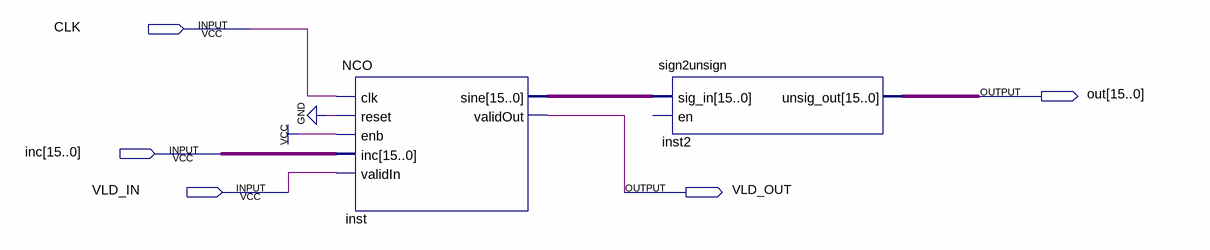
[diagram p0: schematic sheet]
// Quartus schematic Subsystem_quartus.bdf as structural Verilog: 2 symbols, 5 pins
module Subsystem_quartus (
  input  CLK,
  input  [15:0] inc,
  input  VLD_IN,
  output [15:0] out,
  output VLD_OUT
);

  wire [15:0] inst_sine;

  NCO inst (.clk(CLK), .reset(1'b0), .enb(1'b1), .inc(inc), .validIn(VLD_IN), .sine(inst_sine), .validOut(VLD_OUT));
  sign2unsign inst2 (.sig_in(inst_sine), .unsig_out(out));  // open: en
endmodule
